# EAGLE design AlarmShield (EAGLE 8.2.1)
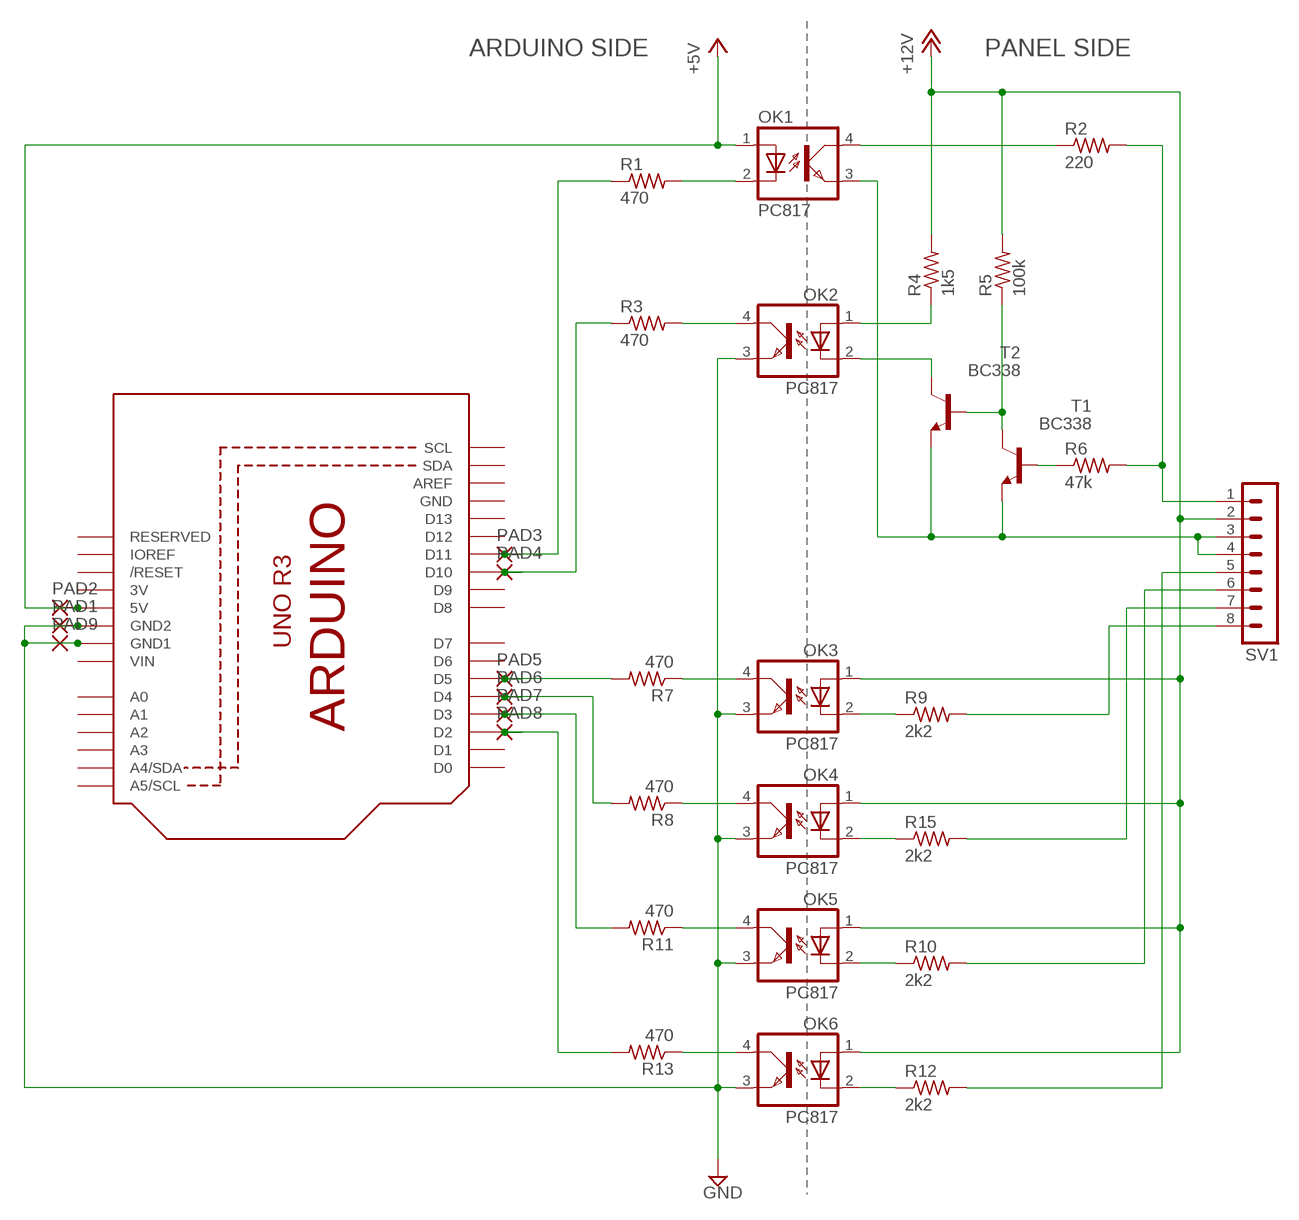
[diagram p0: schematic, sheet 1]

## Parts
OK1  PC817  SFH618A-2  [DIP4]
OK2  PC817  SFH618A-2  [DIP4]
OK3  PC817  SFH618A-2  [DIP4]
OK4  PC817  SFH618A-2  [DIP4]
OK5  PC817  SFH618A-2  [DIP4]
OK6  PC817  SFH618A-2  [DIP4]
PAD1  1,6/0,8  [1,6/0,8]
PAD2  1,6/0,8  [1,6/0,8]
PAD3  1,6/0,8  [1,6/0,8]
PAD4  1,6/0,8  [1,6/0,8]
PAD5  1,6/0,8  [1,6/0,8]
PAD6  1,6/0,8  [1,6/0,8]
PAD7  1,6/0,8  [1,6/0,8]
PAD8  1,6/0,8  [1,6/0,8]
PAD9  1,6/0,8  [1,6/0,8]
R1  470  R-US_0207/10  [0207/10]
R2  220  R-US_0207/10  [0207/10]
R3  470  R-US_0207/10  [0207/10]
R4  1k5  R-US_0207/10  [0207/10]
R5  100k  R-US_0207/10  [0207/10]
R6  47k  R-US_0207/10  [0207/10]
R7  470  R-US_0207/10  [0207/10]
R8  470  R-US_0207/10  [0207/10]
R9  2k2  R-US_0207/10  [0207/10]
R10  2k2  R-US_0207/10  [0207/10]
R11  470  R-US_0207/10  [0207/10]
R12  2k2  R-US_0207/10  [0207/10]
R13  470  R-US_0207/10  [0207/10]
R15  2k2  R-US_0207/10  [0207/10]
SV1  MA08-1  [MA08-1]
T1  BC338  [TO92-EBC]
T2  BC338  [TO92-EBC]
U1  ARDUINOR3-BPLACE  [ARDUINOR3-BPLACE]

## Nets
+5V: OK1.1(A) PAD2.1(P) U1.5V
+12V: OK3.1(A) OK4.1(A) OK5.1(A) OK6.1(A) R4.2 R5.2 SV1.2
GND1: OK2.3(EMIT) OK3.3(EMIT) OK4.3(EMIT) OK5.3(EMIT) OK6.3(EMIT) PAD1.1(P) PAD9.1(P) U1.GND1 U1.GND2 ; supply symbol labelled GND
N$1: OK1.2(C) R1.2
N$2: OK1.3(EMIT) SV1.3 SV1.4 T1.E T2.E
N$3: OK1.4(COL) R2.1
N$4: OK3.4(COL) R7.1
N$5: OK4.4(COL) R8.1
N$6: OK2.1(A) R4.1
N$7: OK2.2(C) T2.C
N$8: R5.1 T1.C T2.B
N$9: PAD3.1(P) R1.1 U1.D11
N$10: R6.1 T1.B
N$12: OK5.4(COL) R11.1
N$13: PAD5.1(P) R7.2 U1.D5
N$14: OK6.4(COL) R13.1
N$16: OK2.4(COL) R3.2
N$17: PAD6.1(P) R8.2 U1.D4
N$18: PAD7.1(P) R11.2 U1.D3
N$19: PAD4.1(P) R3.1 U1.D10
N$20: R2.2 R6.2 SV1.1
N$21: R9.2 SV1.8
N$22: R15.2 SV1.7
N$23: OK4.2(C) R15.1
N$24: PAD8.1(P) R13.2 U1.D2
N$25: R10.2 SV1.6
N$26: OK3.2(C) R9.1
N$27: R12.2 SV1.5
N$28: OK5.2(C) R10.1
N$29: OK6.2(C) R12.1
Unconnected: U1.A0 U1.A1 U1.A2 U1.A3 U1.A4(A4/SDA) U1.A5(A5/SCL) U1.AREF U1.D0 U1.D1 U1.D6 U1.D7 U1.D8 U1.D9 U1.D12 U1.D13 U1.IOREF U1.RESERVED U1.RESET(/RESET) U1.SCL U1.SDA

## Notes on the sheet
- ARDUINO SIDE | PANEL SIDE

## Power pins joined to a net without a drawn wire
3V: U1.3V
GND: U1.GND
VIN: U1.VIN

## Library data of the parts
OK1-OK6 = optocoupler:SFH618?*: Optocoupler, Phototransistor Output, Low Input Current Source: Data sheet <http://www.vishay.com/docs/83673/sfh618.pdf>; MF: VISHAY/TELEFUNKEN; MPN: SFH618A-2; OC_FARNELL: 6424855; OC_NEWARK: 21H7744
PAD1-PAD9 = wirepad:1,6/0,8: THROUGH-HOLE PAD
R1-R13 R15 = adafruit:R-US_: RESISTOR, American symbol
SV1 = con-lstb:MA08-1: PIN HEADER; OC_FARNELL: unknown; OC_NEWARK: unknown
T1 T2 = transistor-npn:BC338*: NPN Transistor
U1 = adafruit:ARDUINOR3: This is a new object for the new Arduino R3 - with extra pins that you may want to use (such as IOref, and duplicated A4/A5

## Board
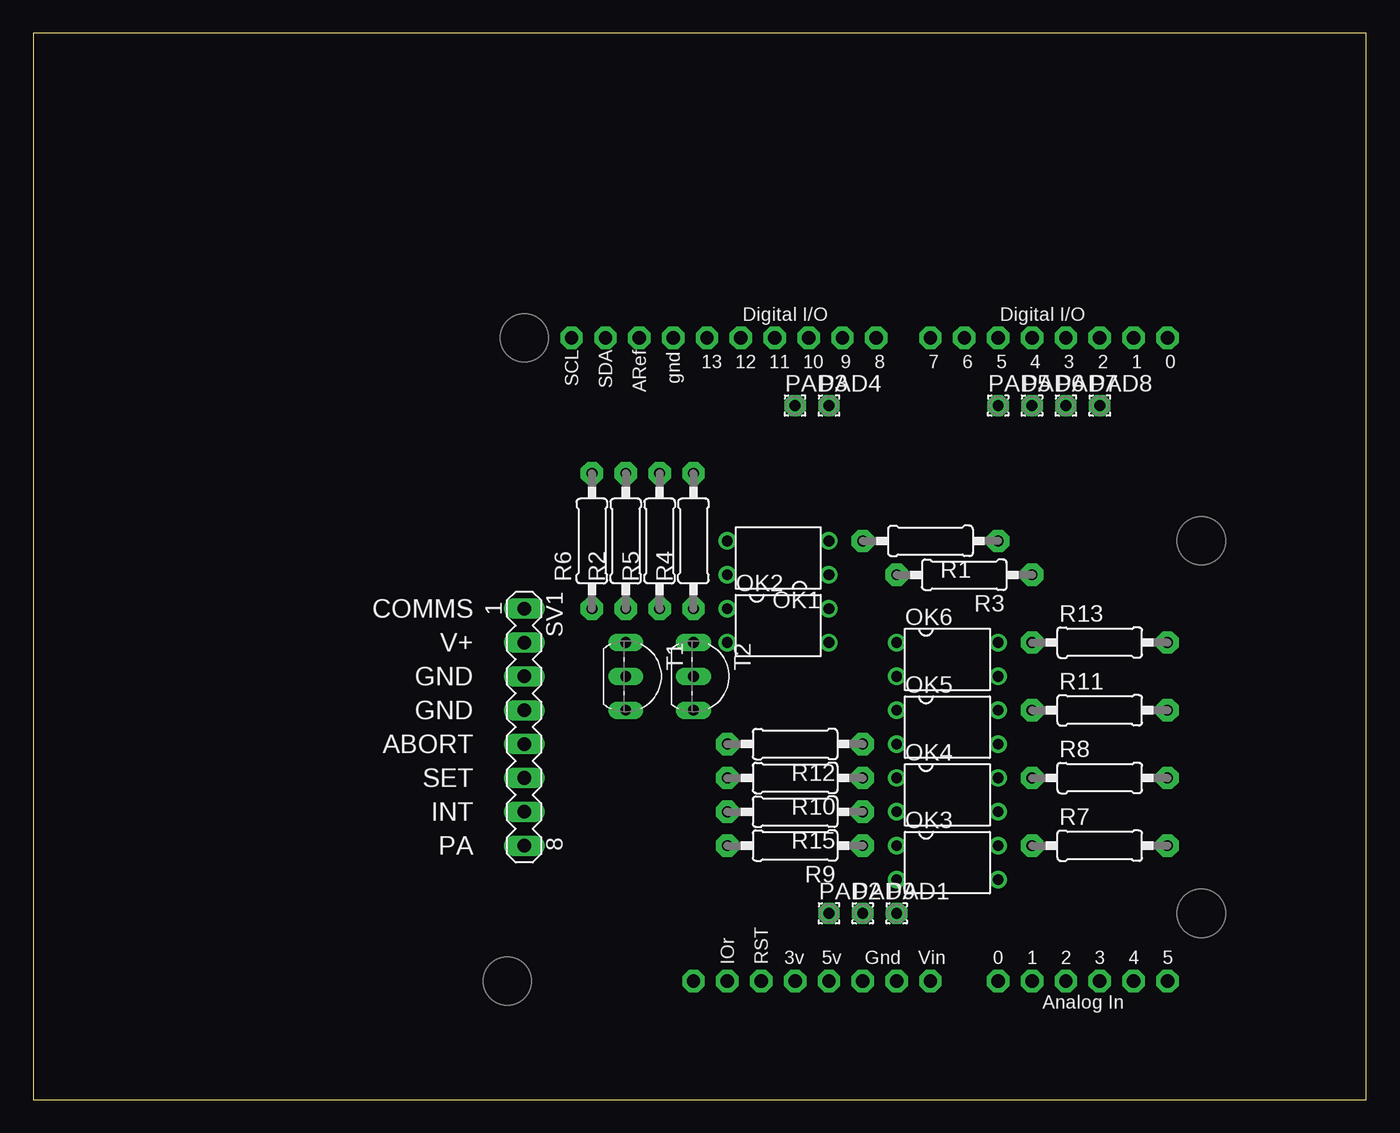
[diagram p1: board, top side]
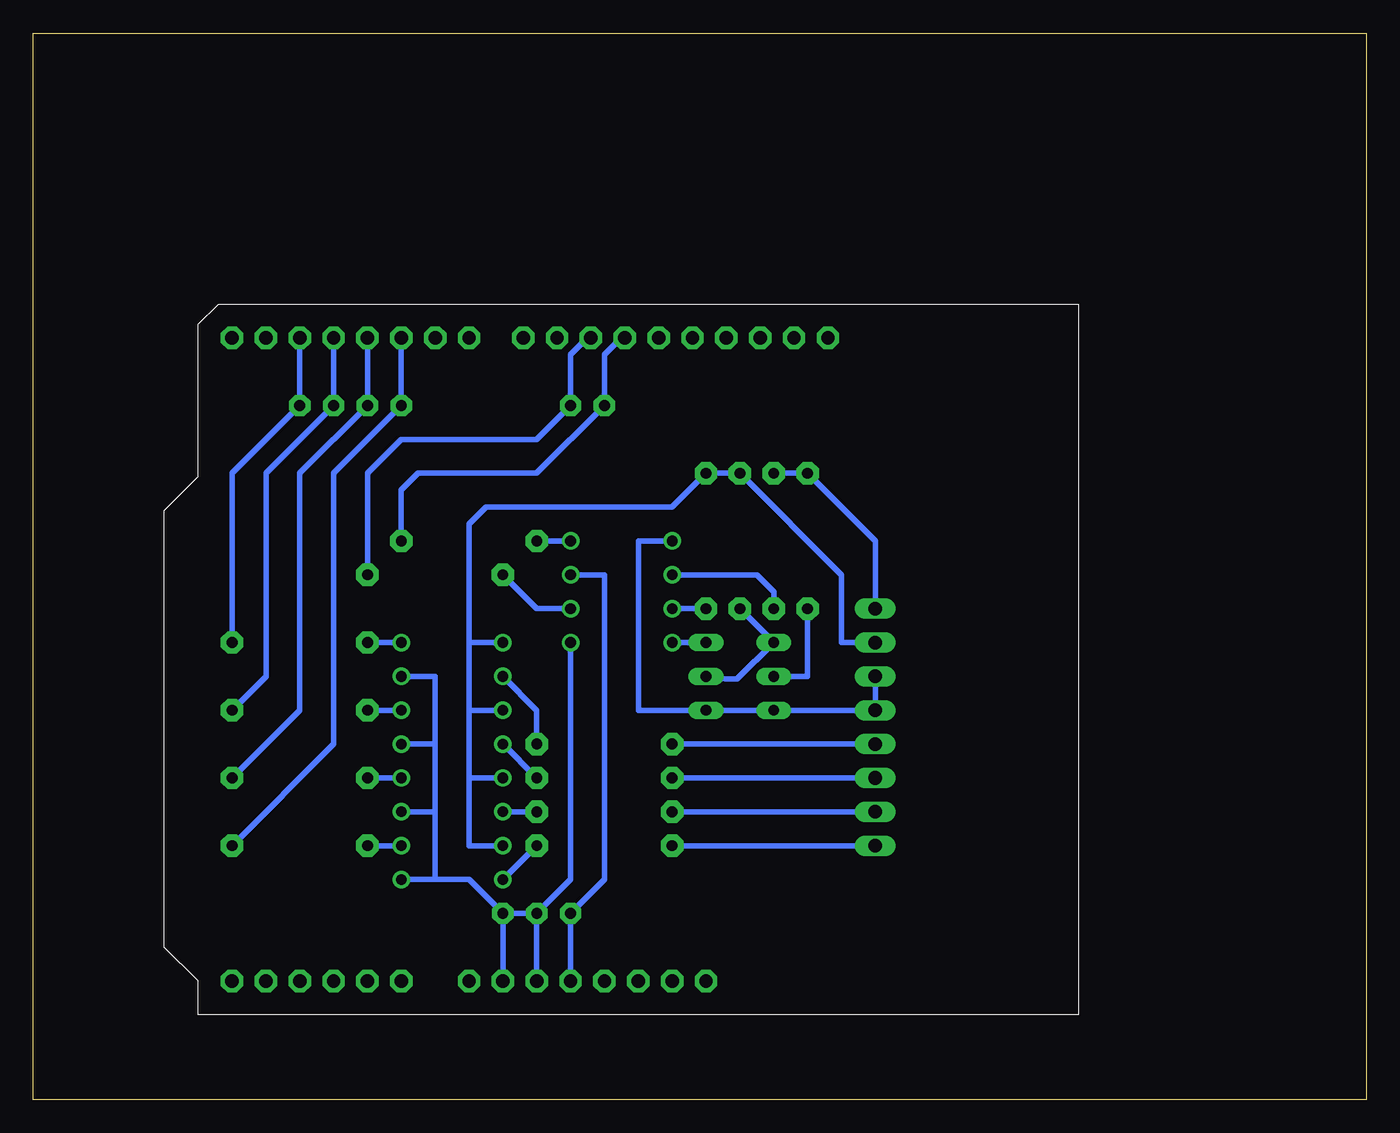
[diagram p2: board, bottom side, seen from below]

Size 100 x 80 mm. Coordinates in mm from the lower left corner, seen from the top.
Outline: 0,0 100,0 100,80 0,80 0,0
Copper layers (1*16): Top 0.035mm / dielectric 1.5mm / Bottom 0.035mm
Design rules "default": minimum track width 10mil, minimum drill 24mil, track to track 8mil, track to pad 8mil, pad to pad 8mil, via to via 8mil, smd to smd 8mil, copper to edge 40mil, drill to drill 8mil, minimum pad ring 10mil, minimum via ring 8mil, stop-mask expansion 4mil, vias tented up to drill 0mil, thermal gap 10mil

### Footprints (pad centres in the part's own frame; a part is rotated, then mirrored left to right if it is on the bottom)
DIP4 = drill 0.8: 1 -1.27,-3.81; 2 1.27,-3.81; 3 1.27,3.81; 4 -1.27,3.81
1,6/0,8 = drill 0.813 pad 1.6 octagon: 1 0,0
0207/10 = drill 0.813 pad 1.676 octagon: 1 -5.08,0; 2 5.08,0
MA08-1 = drill 1.016 long: 1 -8.89,0; 2 -6.35,0; 3 -3.81,0; 4 -1.27,0; 5 1.27,0; 6 3.81,0; 7 6.35,0; 8 8.89,0
TO92-EBC = drill 0.813 long: B 0,-1.27; C -2.54,-1.27; E 2.54,-1.27
ARDUINOR3-BPLACE = drill 1 pad 1.676 octagon: 3V 35.56,2.54; 5V 38.1,2.54; A0 50.8,2.54; A1 53.34,2.54; A2 55.88,2.54; A3 58.42,2.54; A4 60.96,2.54; A5 63.5,2.54; AREF 23.876,50.8; D0 63.5,50.8; D1 60.96,50.8; D2 58.42,50.8; D3 55.88,50.8; D4 53.34,50.8; D5 50.8,50.8; D6 48.26,50.8; D7 45.72,50.8; D8 41.656,50.8; D9 39.116,50.8; D10 36.576,50.8; D11 34.036,50.8; D12 31.496,50.8; D13 28.956,50.8; GND 26.416,50.8; GND1 43.18,2.54; GND2 40.64,2.54; IOREF 30.48,2.54; RESERVED 27.94,2.54; RESET 33.02,2.54; SCL 18.796,50.8; SDA 21.336,50.8; VIN 45.72,2.54

### Placement (x,y rotation side)
OK1  55.88,40.64 90 top
OK2  55.88,35.56 270 top
OK3  68.58,17.78 270 top
OK4  68.58,22.86 270 top
OK5  68.58,27.94 270 top
OK6  68.58,33.02 270 top
PAD1  64.77,13.97 0 top
PAD2  59.69,13.97 0 top
PAD3  57.15,52.07 0 top
PAD4  59.69,52.07 0 top
PAD5  72.39,52.07 0 top
PAD6  74.93,52.07 0 top
PAD7  77.47,52.07 0 top
PAD8  80.01,52.07 0 top
PAD9  62.23,13.97 0 top
R1  67.31,41.91 180 top
R2  44.45,41.91 90 top
R3  69.85,39.37 180 top
R4  49.53,41.91 90 top
R5  46.99,41.91 90 top
R6  41.91,41.91 90 top
R7  80.01,19.05 0 top
R8  80.01,24.13 0 top
R9  57.15,19.05 180 top
R10  57.15,24.13 180 top
R11  80.01,29.21 0 top
R12  57.15,26.67 180 top
R13  80.01,34.29 0 top
R15  57.15,21.59 180 top
SV1  36.83,27.94 270 top
T1  45.72,31.75 270 top
T2  50.8,31.75 270 top
U1  21.59,6.35 0 top

### Tracks (layer width: path | path; a pad name or v marks a point on that pad's centre or on a via)
+5V
  Bottom 0.406: 59.69,12.76 U1.5V PAD2.1 57.15,16.51 57.15,39.37 OK1.1
+12V
  Bottom 0.406: 67.31,24.13 67.31,19.05 OK3.1 | 67.31,29.21 67.31,24.13 | SV1.2 39.37,34.29 39.37,39.37 R5.2 R4.2 52.07,44.45 66.04,44.45 67.31,43.18 67.31,34.29 | 67.31,34.29 67.31,29.21 | OK6.1 67.31,34.29 | OK5.1 67.31,29.21 | OK4.1 67.31,24.13
GND1
  Bottom 0.406: OK6.3 69.85,31.75 69.85,26.67 | 69.85,26.67 OK5.3 | 69.85,26.67 69.85,21.59 | 69.85,21.59 OK4.3 | 69.85,16.51 69.85,21.59 | 69.85,16.51 OK3.3 | 69.85,16.51 67.31,16.51 PAD1.1 | PAD9.1 59.69,16.51 OK2.3 | PAD9.1 U1.GND2 | U1.GND1 PAD1.1 | PAD1.1 PAD9.1
N$1
  Bottom 0.406: R1.2 OK1.2
N$2
  Bottom 0.406: OK1.3 54.61,41.91 54.61,29.21 T2.E T1.E SV1.4 SV1.3
N$3
  Bottom 0.406: R2.1 44.45,38.1 45.72,39.37 OK1.4
N$4
  Bottom 0.406: OK3.4 R7.1
N$5
  Bottom 0.406: OK4.4 R8.1
N$6
  Bottom 0.406: R4.1 OK2.1
N$7
  Bottom 0.406: T2.C OK2.2
N$8
  Bottom 0.406: R5.1 T1.C 47.19,31.55 48.07,31.55 49.13,31.75 T2.B
N$9
  Bottom 0.406: U1.D11 55.88,56.9 56.13,56.9 57.15,55.88 PAD3.1 62.23,46.99 71.12,46.99 72.39,45.72 R1.1
N$10
  Bottom 0.406: 41.99,36.75 R6.1 41.91,31.75 T1.B
N$12
  Bottom 0.406: OK5.4 R11.1
N$13
  Bottom 0.406: U1.D5 PAD5.1 77.47,46.99 77.47,26.67 R7.2
N$14
  Bottom 0.406: R13.1 OK6.4
N$16
  Bottom 0.406: OK2.4 62.23,36.83 R3.2
N$17
  Bottom 0.406: U1.D4 PAD6.1 80.01,46.99 80.01,29.21 R8.2
N$18
  Bottom 0.406: U1.D3 PAD7.1 82.55,46.99 82.55,31.75 R11.2
N$19
  Bottom 0.406: U1.D10 58.42,56.9 58.67,56.9 59.69,55.88 PAD4.1 62.23,49.53 72.39,49.53 74.93,46.99 R3.1
N$20
  Bottom 0.406: R2.2 R6.2 36.83,41.91 SV1.1
N$21
  Bottom 0.406: SV1.8 R9.2
N$22
  Bottom 0.406: SV1.7 R15.2
N$23
  Bottom 0.406: R15.1 OK4.2
N$24
  Bottom 0.406: U1.D2 PAD8.1 85.09,46.99 R13.2
N$25
  Bottom 0.406: SV1.6 R10.2
N$26
  Bottom 0.406: R9.1 OK3.2
N$27
  Bottom 0.406: SV1.5 R12.2
N$28
  Bottom 0.406: R10.1 OK5.2
N$29
  Bottom 0.406: R12.1 62.23,29.21 OK6.2

### Text on the board
tNames: COMMS | V+ | GND | GND | ABORT | SET | INT | PA